# EAGLE design DeadHorsePCB_REV-B_Shrink (EAGLE 8.6.0)
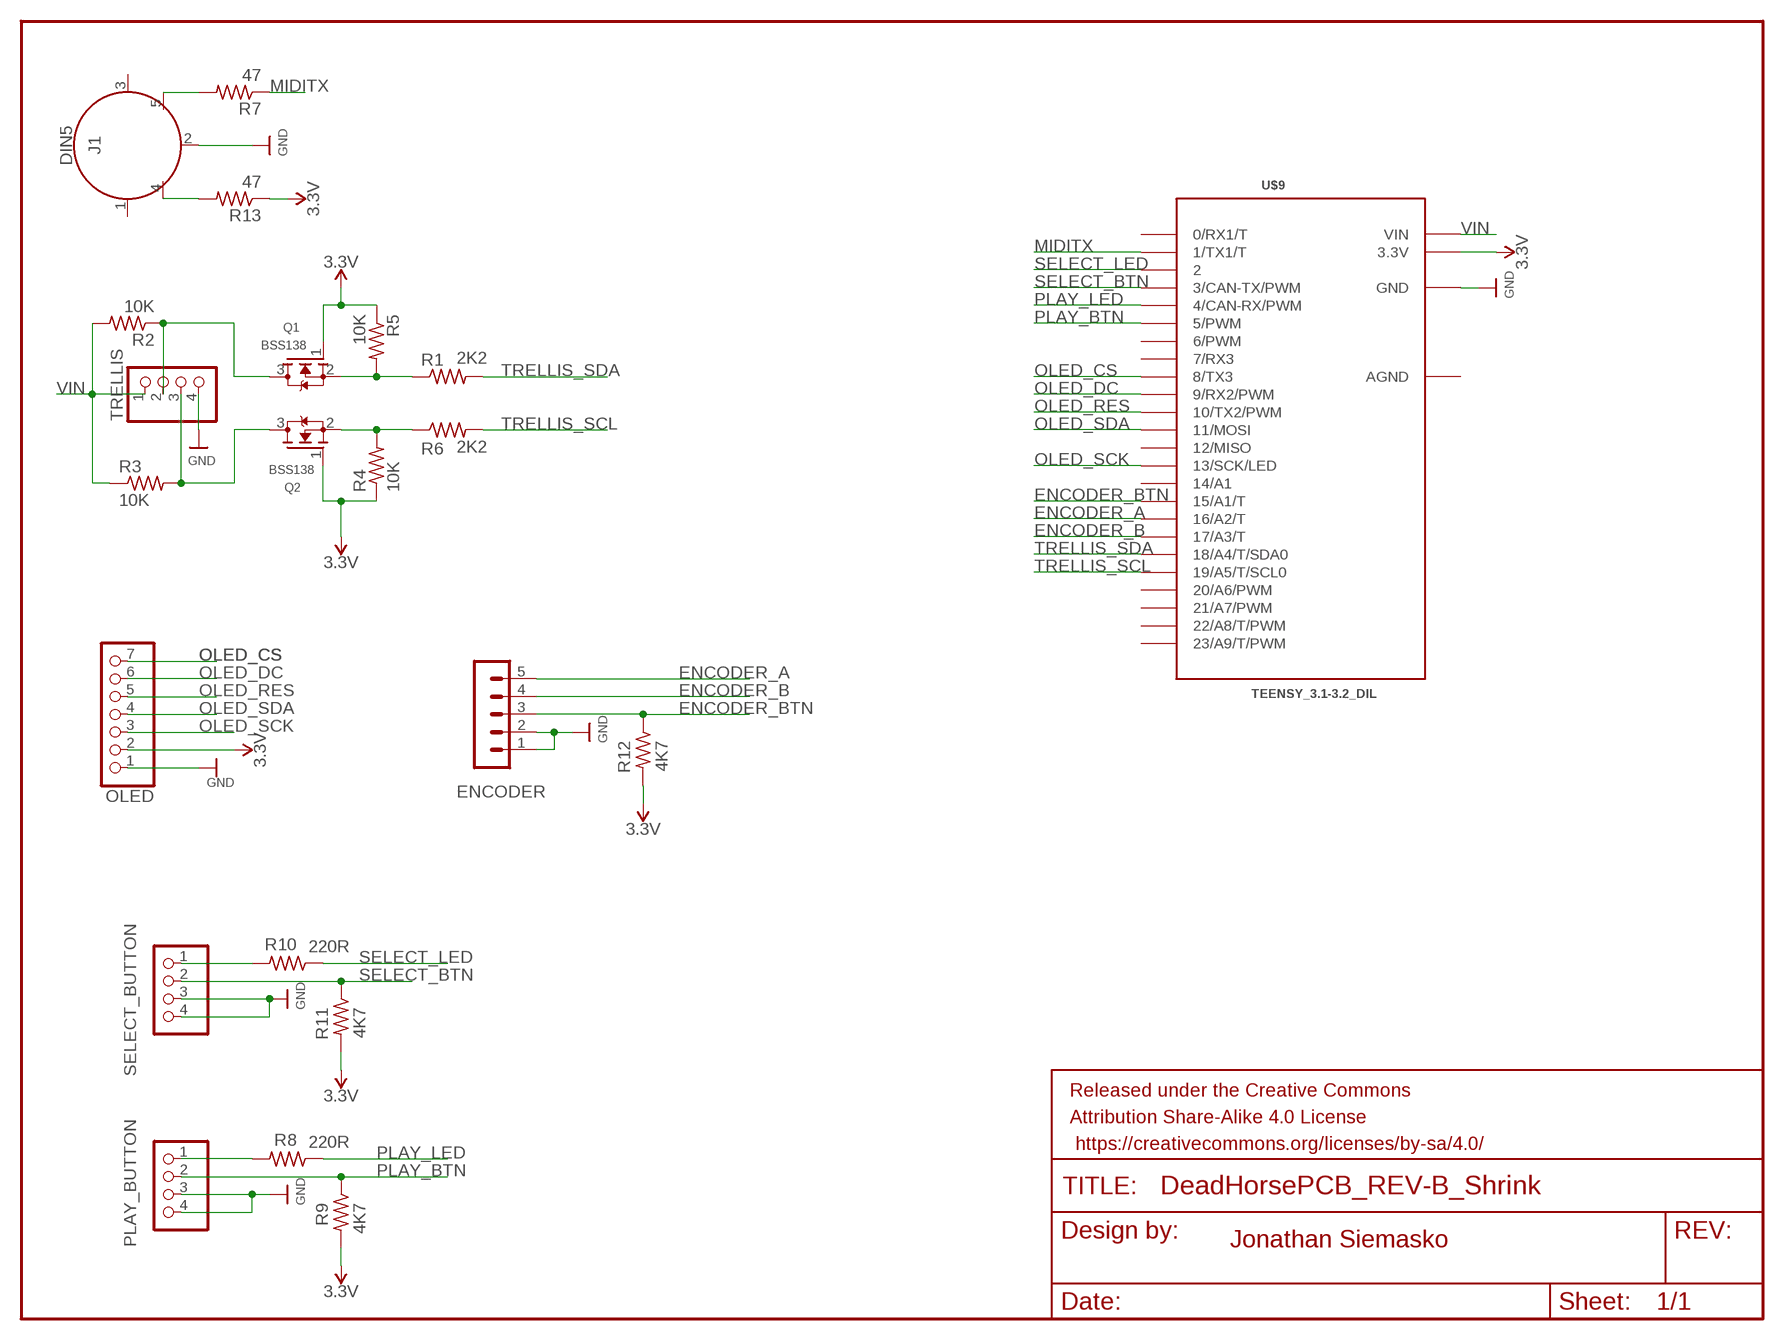
[diagram p0: schematic, sheet 1]

## Parts
ENCODER  ENCODER  MA05-1  [MA05-1]
FRAME1  FRAME-LETTER  [CREATIVE_COMMONS]
J1  DIN5  [DIN5-RA-PTH]
OLED  OLED  PINHD-1X7  [1X07]
PLAY_BUTTON  PlayBtn  PINHD-1X4  [1X04]
Q1  BSS138  MOSFET-NREFLOW  [SOT23]
Q2  BSS138  MOSFET-NREFLOW  [SOT23]
R1  2K2  R-US_R0805  [R0805]
R2  10K  R-US_R0805  [R0805]
R3  10K  R-US_R0805  [R0805]
R4  10K  R-US_R0805  [R0805]
R5  10K  R-US_R0805  [R0805]
R6  2K2  R-US_R0805  [R0805]
R7  47  R-US_R0805  [R0805]
R8  220R  R-US_R0805  [R0805]
R9  4K7  R-US_R0805  [R0805]
R10  220R  R-US_R0805  [R0805]
R11  4K7  R-US_R0805  [R0805]
R12  4K7  R-US_R0805  [R0805]
R13  47  R-US_R0805  [R0805]
SELECT_BUTTON  SelectBtn  PINHD-1X4  [1X04]
TRELLIS  TRELLIS  PINHD-1X4  [1X04]
U$9  TEENSY_3.1-3.2_DIL  [TEENSY_3.0-3.2&LC_DIL]

## Nets
3.3V [3v3 supply]: OLED.2 Q1.1(G) Q2.1(G) R4.1 R5.1 R9.2 R11.2 R12.2 R13.1 U$9.3.3V
ENCODER_A: ENCODER.5 U$9.16/A2(16/A2/T)
ENCODER_B: ENCODER.4 U$9.17/A3(17/A3/T)
ENCODER_BTN: ENCODER.3 R12.1 U$9.15/A1(15/A1/T)
GND [supply]: ENCODER.1 ENCODER.2 J1.2 OLED.1 PLAY_BUTTON.3 PLAY_BUTTON.4 SELECT_BUTTON.3 SELECT_BUTTON.4 TRELLIS.4 U$9.GND
MIDITX: R7.1 U$9.1(1/TX1/T)
N$1: PLAY_BUTTON.1 R8.2
N$2: Q1.3(D) R2.1 TRELLIS.2
N$3: J1.4 R13.2
N$4: J1.5 R7.2
N$5: Q1.2(S) R1.1 R5.2
N$8: Q2.3(D) R3.2 TRELLIS.3
N$12: Q2.2(S) R4.2 R6.1
N$18: R10.2 SELECT_BUTTON.1
OLED_CS: OLED.7 U$9.8(8/TX3)
OLED_DC: OLED.6 U$9.9(9/RX2/PWM)
OLED_RES: OLED.5 U$9.10(10/TX2/PWM)
OLED_SCK: OLED.3 U$9.13(13/SCK/LED)
OLED_SDA: OLED.4 U$9.11(11/MOSI)
PLAY_BTN: PLAY_BUTTON.2 R9.1 U$9.5(5/PWM)
PLAY_LED: R8.1 U$9.4(4/CAN-RX/PWM)
SELECT_BTN: R11.1 SELECT_BUTTON.2 U$9.3(3/CAN-TX/PWM)
SELECT_LED: R10.1 U$9.2
TRELLIS_SCL: R6.2 U$9.19/A5(19/A5/T/SCL0)
TRELLIS_SDA: R1.2 U$9.18/A4(18/A4/T/SDA0)
VIN [5v supply]: R2.2 R3.1 TRELLIS.1 U$9.VIN
Unconnected: J1.1 J1.3 U$9.0(0/RX1/T) U$9.6(6/PWM) U$9.7(7/RX3) U$9.12(12/MISO) U$9.14/A0(14/A1) U$9.20/A6(20/A6/PWM) U$9.21/A7(21/A7/PWM) U$9.22/A8(22/A8/T/PWM) U$9.23/A9(23/A9/T/PWM)

## Notes on the sheet
- Jonathan Siemasko

## Power pins joined to a net without a drawn wire
AGND: U$9.AGND

## Library data of the parts
ENCODER = con-lstb:MA05-1: PIN HEADER; OC_FARNELL: unknown; OC_NEWARK: unknown
FRAME1 = SparkFun-Aesthetics:FRAME-LETTER: Schematic Frame - Letter Standard 8.5x11 US Letter frame
J1 = SparkFun-Connectors:DIN5: DIN5 Connector - Female Right Angle (frequently used as a MIDI Jack connector) This type of connector and cable is frequently used for transmitting midi data (musical instrument digital interface). It is what you usually see on a keyboard or set of electronic drums. Learn more here <https://en.wikipedia.org/wiki/MIDI>. For more information on the pinout and electrical specifications of MIDI communications, please see the following resource: https://www.midi.org/specifications/item/midi-din-electrical-specification Here is the connector we sell at SparkFun: MIDI Connector - Female Right Angle <https://www.sparkfun.com/products/9536> (PRT-09536) Datasheet <hhttp://www.sparkfun.com/datasheets/Prototyping/Connectors/MIDI-RA.pdf> It is used on this SparkFun product: SparkFun MIDI Shield <https://www.sparkfun.com/products/12898> (DEV-12898); PROD_ID: CONN-09481
OLED = pinhead:PINHD-1X7: PIN HEADER
PLAY_BUTTON SELECT_BUTTON TRELLIS = pinhead:PINHD-1X4: PIN HEADER
Q1 Q2 = adafruit:MOSFET-N: N-Channel Mosfet 2N7002E - 60V 260mA SOT23 [Digikey: 2N7002ET1GOSTR-ND] - REEL BSH103 - 30V 850mA SOT23 [Digikey: 568-5013-1-ND]
R1-R13 = adafruit:R-US_: RESISTOR, American symbol
U$9 = Teensy_3_and_LC_Series_Boards_v1.4:TEENSY_3.1-3.2_DIL: Teensy 3.1 or 3.2 in a DIL Layout.

## Board
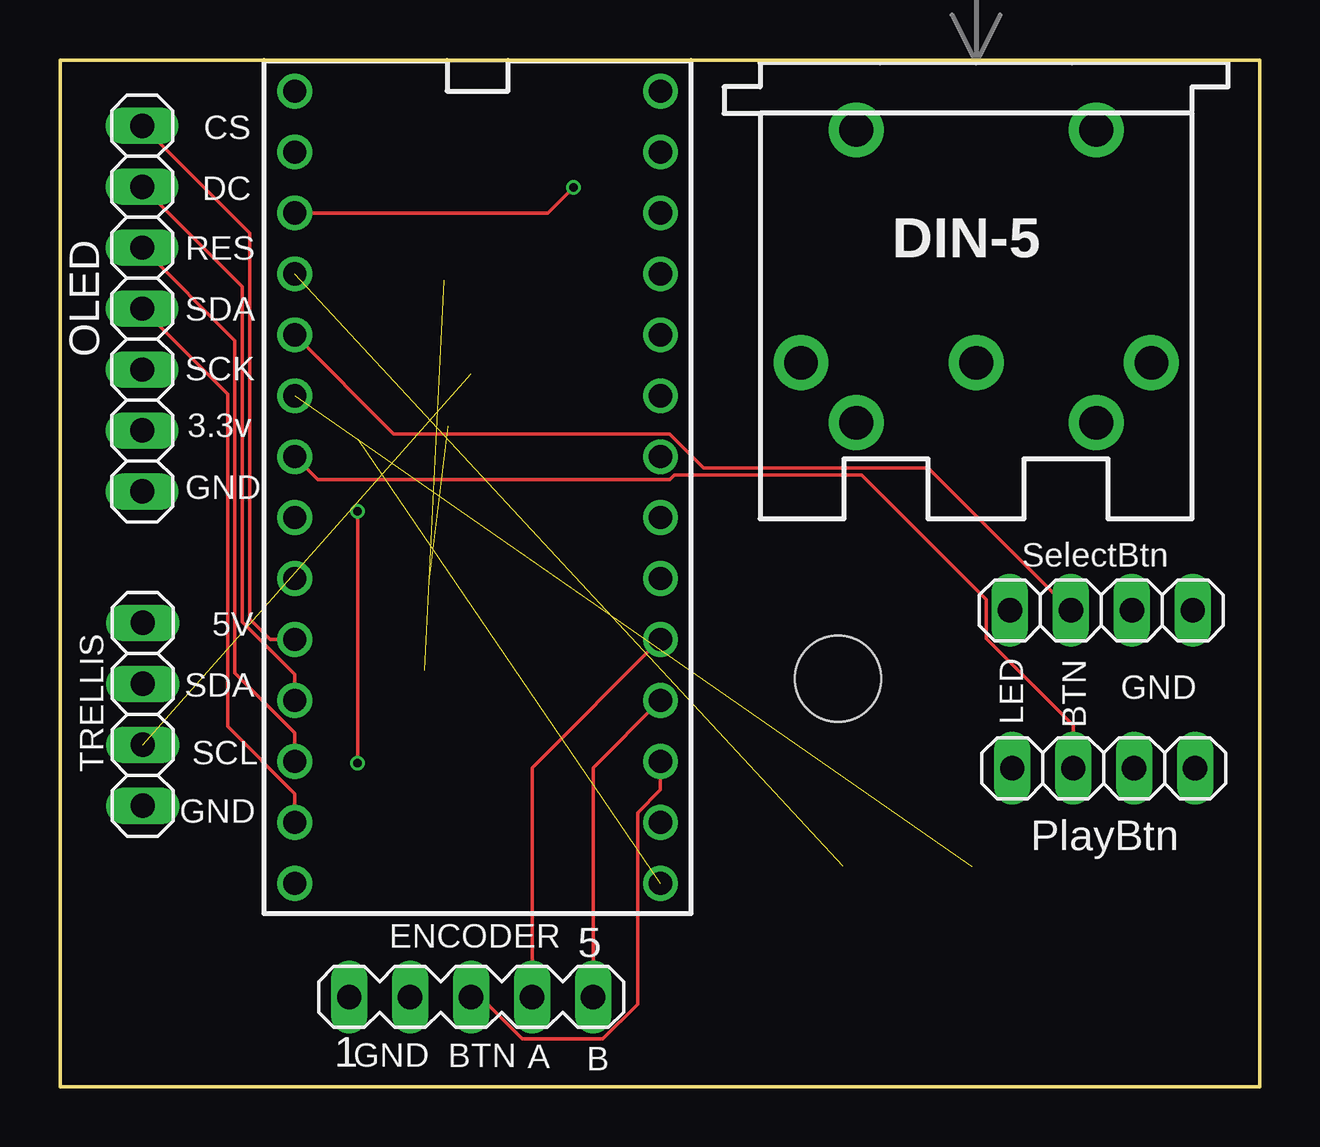
[diagram p1: board, top side]
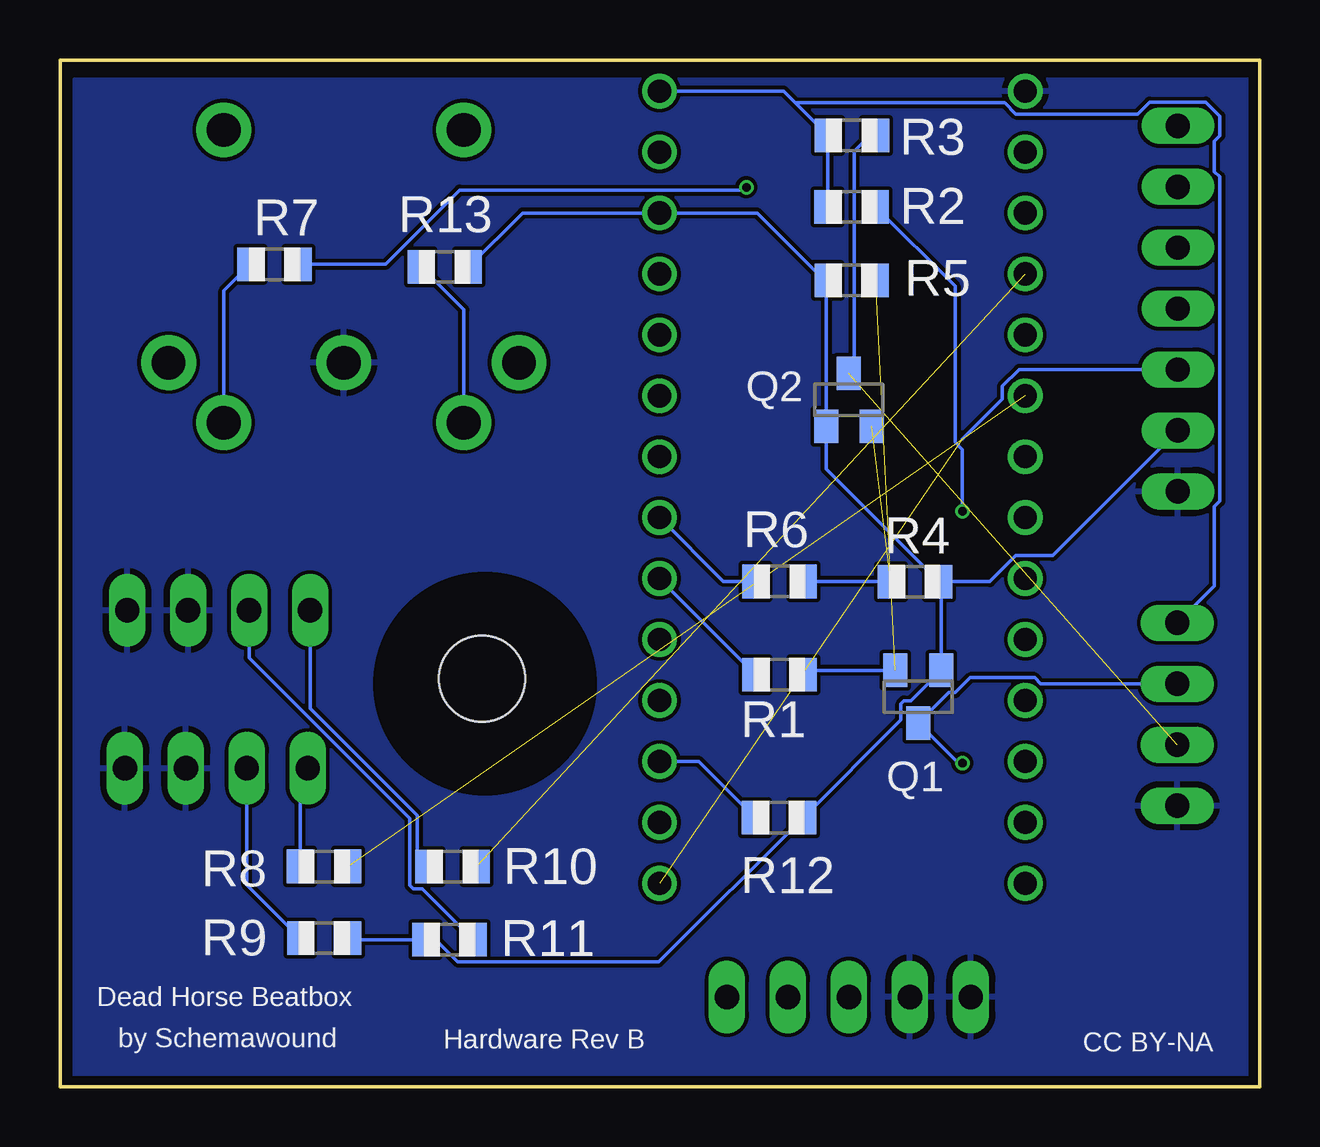
[diagram p2: board, bottom side, seen from below]

Size 50 x 42.81 mm. Coordinates in mm from the lower left corner, seen from the top.
Outline: 0,42.81 50,42.81 50,0 0,0 0,42.81
Copper layers (1*16): Top 0.035559375mm / dielectric 1.6mm / Bottom 0.035559375mm
Design rules "oshpark-2layer": minimum track width 6mil, minimum drill 10mil, track to track 6mil, track to pad 6mil, pad to pad 6mil, via to via 6mil, smd to smd 6mil, copper to edge 15mil, drill to drill 6mil, minimum pad ring 5mil, minimum via ring 5mil, stop-mask expansion 2.5mil, vias tented up to drill 0mil, thermal gap 10mil
Holes 3.6 mm at 32.42,17.02
bRestrict: area 27.7,12.2 to 36.9,21.4

### Footprints (pad centres in the part's own frame; a part is rotated, then mirrored left to right if it is on the bottom)
MA05-1 = drill 1.016 long: 1 -5.08,0; 2 -2.54,0; 3 0,0; 4 2.54,0; 5 5.08,0
DIN5-RA-PTH = drill 1.4 pad 2.286: 1 7.3,12.5; 2 0,12.5; 3 -7.3,12.5; 4 5,15; 5 -5,15; 6 -5,2.8; 7 5,2.8
1X07 = drill 1.016 long: 1 -7.62,0; 2 -5.08,0; 3 -2.54,0; 4 0,0; 5 2.54,0; 6 5.08,0; 7 7.62,0
1X04 = drill 1.016 long: 1 -3.81,0; 2 -1.27,0; 3 1.27,0; 4 3.81,0
SOT23 = smd 1 x 1.4: 1 -0.95,-1.1; 2 0.95,-1.1; 3 0,1.1
R0805 = smd 1.1 x 1.4: 1 -1,0; 2 1,0
TEENSY_3.0-3.2&LC_DIL = drill 0.965: 0 -7.62,13.97; 1 -7.62,11.43; 2 -7.62,8.89; 3 -7.62,6.35; 3.3V 7.62,11.43; 4 -7.62,3.81; 5 -7.62,1.27; 6 -7.62,-1.27; 7 -7.62,-3.81; 8 -7.62,-6.35; 9 -7.62,-8.89; 10 -7.62,-11.43; 11 -7.62,-13.97; 12 -7.62,-16.51; 13 7.62,-16.51; 14/A0 7.62,-13.97; 15/A1 7.62,-11.43; 16/A2 7.62,-8.89; 17/A3 7.62,-6.35; 18/A4 7.62,-3.81; 19/A5 7.62,-1.27; 20/A6 7.62,1.27; 21/A7 7.62,3.81; 22/A8 7.62,6.35; 23/A9 7.62,8.89; AGND 7.62,13.97; GND -7.62,16.51; VIN 7.62,16.51

### Placement (x,y rotation side)
ENCODER  17.13,3.75 0 top
FRAME1  -23.47,-49.97 0 top  (outside the outline)
J1  38.18,42.69 180 top
OLED  3.42,32.44 90 top
PLAY_BUTTON  43.49,13.28 0 top
Q1  14.24,16.27 180 bottom
Q2  17.13,28.64 0 bottom
R1  20.03,17.19 180 bottom
R2  17.01,36.68 180 bottom
R3  17.01,39.66 0 bottom
R4  14.38,21.07 180 bottom
R5  17.01,33.63 0 bottom
R6  20.01,21.07 180 bottom
R7  41.07,34.29 180 bottom
R8  39,9.19 180 bottom
R9  38.99,6.2 0 bottom
R10  33.64,9.19 180 bottom
R11  33.77,6.14 180 bottom
R12  20.04,11.22 0 bottom
R13  33.97,34.19 180 bottom
SELECT_BUTTON  43.39,19.87 0 top
TRELLIS  3.45,15.53 270 top
U$9  17.4,25 0 top

### Tracks (layer width: path | path; a pad name or v marks a point on that pad's centre or on a via)
3.3V
  Bottom 0.152: R5.1 18.08,33.56 | 18.08,33.56 Q2.1 18.08,25.77 R4.1 | 18.08,33.56 20.96,36.43 U$9.3.3V 30.73,36.43 R13.1 | R9.2 37.93,6.14 R11.2 34.35,6.14 33.42,5.21 25.05,5.21 R12.2 14.97,15.29 14.97,15.96 14.83,16.1 14.56,16.1 Q1.1 13.29,20.97 R4.1 | OLED.2 8.65,22.14 10.17,22.14 11.25,21.07 R4.1
ENCODER_A
  Top 0.152: ENCODER.5 22.21,13.3 U$9.16/A2
ENCODER_B
  Top 0.152: ENCODER.4 19.67,13.3 U$9.17/A3
ENCODER_BTN
  Top 0.152: U$9.15/A1 25.02,12.38 24.07,11.42 24.07,3.44 22.62,2 19.26,2 17.51,3.75 ENCODER.3
  Bottom 0.152: R12.1 23.39,13.57 U$9.15/A1
GND
  pour Bottom: -4.6,42 49.4,42 49.4,-19 -4.6,-19
MIDITX  (via drill 0.35)
  Top 0.152: v21.4,37.5 20.33,36.43 U$9.1
  Bottom 0.152: R7.1 36.43,34.29 33.35,37.38 21.52,37.38 v21.4,37.5
N$1
  Bottom 0.152: R8.2 40,12.97 PLAY_BUTTON.1
N$2  (via drill 0.35)
  Top 0.152: v12.4,24 v12.4,13.5 12.4,13.43 12.39,13.43
  Bottom 0.152: TRELLIS.2 9.13,16.8 9.38,17.06 12.07,17.06 12.7,16.44 12.97,16.44 Q1.3 12.57,13.5 v12.4,13.5 | v12.4,24 12.4,26.57 12.7,26.87 12.7,33.37 R2.1
N$3
  Bottom 0.152: J1.4 33.18,32.39 R13.2
N$4
  Bottom 0.152: J1.5 43.18,33.18 R7.2
N$5  (1 unrouted)
  Bottom 0.152: Q1.2 18.85,17.37 R1.1
N$8  (1 unrouted)
  Bottom 0.152: Q2.3 16.9,29.97 16.9,39 16.23,39.67 R3.2
N$12  (1 unrouted)
  Bottom 0.152: R4.2 R6.1
N$18
  Bottom 0.152: SELECT_BUTTON.1 39.58,15.78 35.12,11.31 35.12,9.66 R10.2
OLED_CS
  Top 0.152: OLED.7 7.9,35.59 7.9,19.5 8.75,18.65 U$9.8
OLED_DC
  Top 0.152: OLED.6 7.59,33.35 7.59,19.37 9.78,17.19 U$9.9
OLED_RES
  Top 0.152: OLED.5 7.29,31.12 7.29,17.25 9.78,14.76 U$9.10
OLED_SCK  (1 unrouted)
  Bottom 0.152: 12.4,27 10.73,28.67 10.73,29.2 10.03,29.9 OLED.3
OLED_SDA
  Top 0.152: OLED.4 6.99,28.88 6.99,15.02 9.78,12.22 U$9.11
PLAY_BTN
  Top 0.152: U$9.5 10.73,25.32 25.41,25.32 25.6,25.5 33.4,25.5 38.59,20.31 38.59,18.69 42.22,15.06 PLAY_BUTTON.2
  Bottom 0.152: R9.1 42.22,8.42 PLAY_BUTTON.2
PLAY_LED  (1 unrouted)
SELECT_BTN
  Top 0.152: U$9.3 13.91,27.22 25.41,27.22 26.83,25.8 36.18,25.8 SELECT_BUTTON.2
  Bottom 0.152: R11.1 34.9,8.26 35.29,8.26 35.42,8.39 35.42,11.19 42.12,17.89 SELECT_BUTTON.2
SELECT_LED  (1 unrouted)
TRELLIS_SCL
  Bottom 0.152: R6.2 22.36,21.07 U$9.19/A5
TRELLIS_SDA
  Bottom 0.152: R1.2 U$9.18/A4
VIN
  Bottom 0.152: R2.2 R3.1 19.37,41.03 | 19.37,41.03 19.85,41.51 U$9.VIN | 19.37,41.03 10.64,41.03 10.17,40.56 5.09,40.56 4.6,41.05 2.25,41.05 1.67,40.47 1.67,39.65 1.9,39.42 1.9,38.16 1.67,37.93 1.67,24.41 1.9,24.19 1.9,20.89 TRELLIS.1

### Text on the board
tPlace: CS | DC | RES | SDA | SCK | 3.3v | GND | 5V | LED | BTN | SDA | GND | SCL | GND | GND | A | B | BTN
bPlace: Dead Horse Beatbox | Hardware Rev B | by Schemawound | CC BY-NA